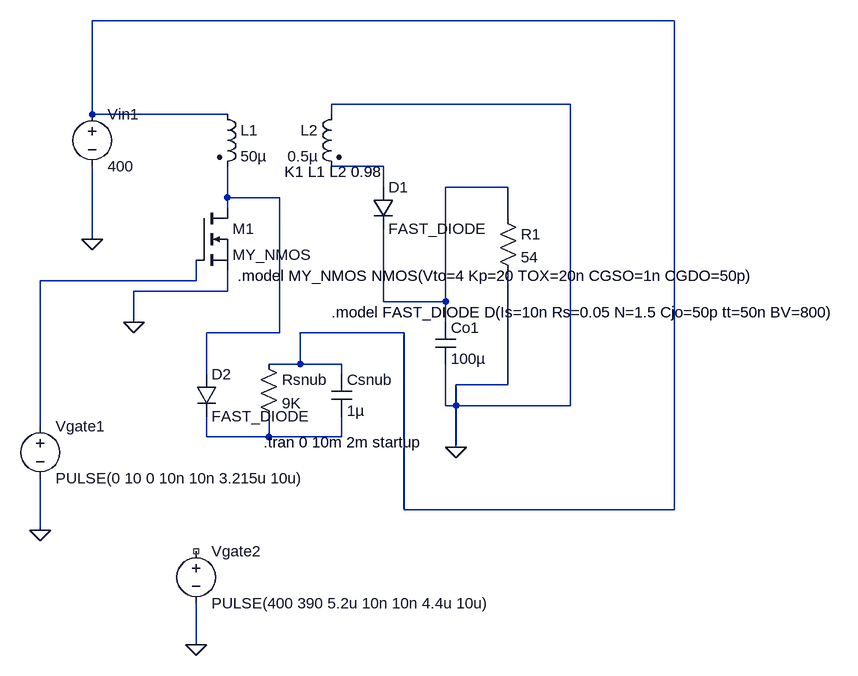
[diagram p0: schematic 10or11-06-26_Flyback.asc]
10or11-06-26_Flyback.asc, the LTspice schematic file:
Version 4
SHEET 1 1056 680
WIRE 736 -368 -160 -368
WIRE 576 -240 208 -240
WIRE -160 -224 -160 -368
WIRE 48 -224 -160 -224
WIRE 208 -224 208 -240
WIRE 288 -144 208 -144
WIRE 288 -112 288 -144
WIRE 480 -112 384 -112
WIRE 48 -96 48 -144
WIRE 128 -96 48 -96
WIRE 48 -80 48 -96
WIRE 480 -64 480 -112
WIRE -160 -32 -160 -144
WIRE 0 32 0 0
WIRE 0 32 -240 32
WIRE 48 48 48 16
WIRE 48 48 -96 48
WIRE 288 64 288 -48
WIRE 384 64 384 -112
WIRE 384 64 288 64
WIRE -96 96 -96 48
WIRE 384 96 384 64
WIRE 128 112 128 -96
WIRE 128 112 16 112
WIRE 320 112 160 112
WIRE 160 160 160 112
WIRE 160 160 112 160
WIRE 224 160 160 160
WIRE 16 176 16 112
WIRE 224 176 224 160
WIRE 480 192 480 16
WIRE 480 192 400 192
WIRE 384 224 384 160
WIRE 400 224 400 192
WIRE 400 224 384 224
WIRE 576 224 576 -240
WIRE 576 224 400 224
WIRE -240 256 -240 32
WIRE 16 272 16 240
WIRE 112 272 112 240
WIRE 112 272 16 272
WIRE 224 272 224 240
WIRE 224 272 112 272
WIRE 400 288 400 224
WIRE 320 384 320 112
WIRE 736 384 736 -368
WIRE 736 384 320 384
WIRE -240 416 -240 336
WIRE 0 592 0 528
FLAG 400 288 0
FLAG -96 96 0
FLAG -240 416 0
FLAG -160 -32 0
FLAG 0 592 0
DATAFLAG -64 48 ""
SYMBOL voltage -160 -240 R0
WINDOW 123 0 0 Left 0
WINDOW 39 0 0 Left 0
SYMATTR InstName Vin1
SYMATTR Value 400
SYMBOL ind2 32 -240 R0
SYMATTR InstName L1
SYMATTR Value 50µ
SYMATTR Type ind
SYMBOL ind2 224 -240 M0
SYMATTR InstName L2
SYMATTR Value 0.5µ
SYMATTR Type ind
SYMBOL cap 368 96 R0
SYMATTR InstName Co1
SYMATTR Value 100µ
SYMBOL res 464 -80 R0
SYMATTR InstName R1
SYMATTR Value 54
SYMBOL nmos 0 -80 R0
SYMATTR InstName M1
SYMATTR Value MY_NMOS
SYMBOL diode 272 -112 R0
SYMATTR InstName D1
SYMATTR Value FAST_DIODE
SYMBOL voltage -240 240 R0
WINDOW 123 0 0 Left 0
WINDOW 39 0 0 Left 0
SYMATTR InstName Vgate1
SYMATTR Value PULSE(0 10 0 10n 10n 3.215u 10u)
SYMBOL voltage 0 432 R0
WINDOW 123 0 0 Left 0
WINDOW 39 0 0 Left 0
SYMATTR InstName Vgate2
SYMATTR Value PULSE(400 390 5.2u 10n 10n 4.4u 10u)
SYMBOL diode 0 176 R0
SYMATTR InstName D2
SYMATTR Value FAST_DIODE
SYMBOL res 96 144 R0
SYMATTR InstName Rsnub
SYMATTR Value 9K
SYMBOL cap 208 176 R0
SYMATTR InstName Csnub
SYMATTR Value 1µ
TEXT 136 -136 Left 2 !K1 L1 L2 0.98
TEXT 104 280 Left 2 !.tran 0 10m 2m startup
TEXT 64 24 Left 2 !.model MY_NMOS NMOS(Vto=4 Kp=20 TOX=20n CGSO=1n CGDO=50p)
TEXT 208 80 Left 2 !.model FAST_DIODE D(Is=10n Rs=0.05 N=1.5 Cjo=50p tt=50n BV=800)

The netlist it stands for:
* 10or11-06-26_Flyback.asc
Vin1 N001 0 400
L1 N001 N004 50µ
L2 0 N002 0.5µ
Co1 N003 0 100µ
R1 N003 0 54
M1 N004 N005 0 0 MY_NMOS
D1 N002 N003 FAST_DIODE
Vgate1 N005 0 PULSE(0 10 0 10n 10n 3.215u 10u)
Vgate2 NC_01 0 PULSE(400 390 5.2u 10n 10n 4.4u 10u)
D2 N004 N006 FAST_DIODE
Rsnub N001 N006 9K
Csnub N001 N006 1µ
.model D D
.lib standard.dio
.model NMOS NMOS
.model PMOS PMOS
.lib standard.mos
K1 L1 L2 0.98
.tran 0 10m 2m startup
.model MY_NMOS NMOS(Vto=4 Kp=20 TOX=20n CGSO=1n CGDO=50p)
.model FAST_DIODE D(Is=10n Rs=0.05 N=1.5 Cjo=50p tt=50n BV=800)
.backanno
.end